# EAGLE schematic dobbel_sch (EAGLE 4.16)
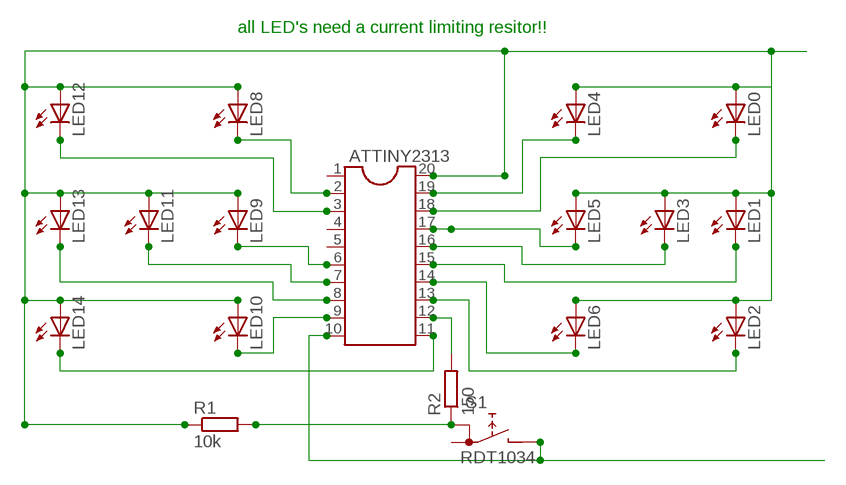
[diagram p0: schematic, sheet 1]

## Parts
ATTINY2313  DIL20  [DIL20]
LED0  LED5MM  [LED5MM]
LED1  LED5MM  [LED5MM]
LED2  LED5MM  [LED5MM]
LED3  LED5MM  [LED5MM]
LED4  LED5MM  [LED5MM]
LED5  LED5MM  [LED5MM]
LED6  LED5MM  [LED5MM]
LED8  LED5MM  [LED5MM]
LED9  LED5MM  [LED5MM]
LED10  LED5MM  [LED5MM]
LED11  LED5MM  [LED5MM]
LED12  LED5MM  [LED5MM]
LED13  LED5MM  [LED5MM]
LED14  LED5MM  [LED5MM]
R1  10k  R-EU_0204/7  [0204/7]
R2  150  R-EU_0204/7  [0204/7]
S1  RDT1034  [RDT1034]

## Nets
N$1: ATTINY2313.20 LED0.A LED1.A LED2.A LED3.A LED4.A LED5.A LED6.A LED8.A LED9.A LED10.A LED11.A LED12.A LED13.A LED14.A R1.1
N$2: ATTINY2313.10 S1.B
N$3: ATTINY2313.18 LED0.K(C)
N$4: ATTINY2313.19 LED4.K(C)
N$5: ATTINY2313.17 LED5.K(C)
N$6: ATTINY2313.16 LED3.K(C)
N$7: ATTINY2313.15 LED1.K(C)
N$8: ATTINY2313.14 LED6.K(C)
N$9: ATTINY2313.13 LED2.K(C)
N$10: ATTINY2313.12 R2.2
N$11: ATTINY2313.2 LED8.K(C)
N$12: ATTINY2313.3 LED12.K(C)
N$13: ATTINY2313.6 LED9.K(C)
N$14: ATTINY2313.7 LED11.K(C)
N$15: ATTINY2313.8 LED13.K(C)
N$16: ATTINY2313.11 LED14.K(C)
N$17: ATTINY2313.9 LED10.K(C)
N$18: R1.2 R2.1 S1.A
Unconnected: ATTINY2313.1 ATTINY2313.4 ATTINY2313.5 S1.A1

## Notes on the sheet
- all LED's need a current limiting resitor!!

## Library data of the parts
ATTINY2313 = ic-package:DIL20: Dual In Line
LED0 LED1-LED6 LED8-LED14 = led:LED: LED OSRAM: - CHIPLED LG R971, LG N971, LY N971, LG Q971, LY Q971, LO R971, LY R971 LH N974, LH R974 LS Q976, LO Q976, LY Q976 LO Q996 - Hyper CHIPLED LW Q18S LB Q993, LB Q99A, LB R99A - SideLED LS A670, LO A670, LY A670, LG A670, LP A670 LB A673, LV A673, LT A673, LW A673 LH A674 LY A675 LS A676, LA A676, LO A676, LY A676, LW A676 LS A679, LY A679, LG A679 - Hyper Micro SIDELED® LS Y876, LA Y876, LO Y876, LY Y876 LT Y87S - SmartLED LW L88C, LW L88S LB L89C, LB L89S, LG L890 LS L89K, LO L89K, LY L89K LS L896, LA L896, LO L896, LY L896 - TOPLED LS T670, LO T670, LY T670, LG T670, LP T670 LSG T670, LSP T670, LSY T670, LOP T670, LYG T670 LG T671, LOG T671, LSG T671 LB T673, LV T673, LT T673, LW T673 LH T674 LS T676, LA T676, LO T676, LY T676, LB T676, LH T676, LSB T676, LW T676 LB T67C, LV T67C, LT T67C, LS T67K, LO T67K, LY T67K, LW E67C LS E67B, LA E67B, LO E67B, LY E67B, LB E67C, LV E67C, LT E67C LW T67C LS T679, LY T679, LG T679 LS T770, LO T770, LY T770, LG T770, LP T770 LB T773, LV T773, LT T773, LW T773 LH T774 LS E675, LA E675, LY E675, LS T675 LS T776, LA T776, LO T776, LY T776, LB T776 LHGB T686 LT T68C, LB T68C - Hyper Mini TOPLED® LB M676 - Mini TOPLED Santana® LG M470 LS M47K, LO M47K, LY M47K Source: http://www.osram.convergy.de - LUMILED® LXK2-PW12-R00, LXK2-PW12-S00, LXK2-PW14-U00, LXK2-PW14-V00 LXK2-PM12-R00, LXK2-PM12-S00, LXK2-PM14-U00 LXK2-PE12-Q00, LXK2-PE12-R00, LXK2-PE12-S00, LXK2-PE14-T00, LXK2-PE14-U00 LXK2-PB12-K00, LXK2-PB12-L00, LXK2-PB12-M00, LXK2-PB14-N00, LXK2-PB14-P00, LXK2-PB14-Q00 LXK2-PR12-L00, LXK2-PR12-M00, LXK2-PR14-Q00, LXK2-PR14-R00 LXK2-PD12-Q00, LXK2-PD12-R00, LXK2-PD12-S00 LXK2-PH12-R00, LXK2-PH12-S00 LXK2-PL12-P00, LXK2-PL12-Q00, LXK2-PL12-R00 Source: www.luxeon.com
R1 R2 = rcl:R-EU_: RESISTOR, European symbol
S1 = switch:RDT1034: PUSH SWITCH www.radiohm.com